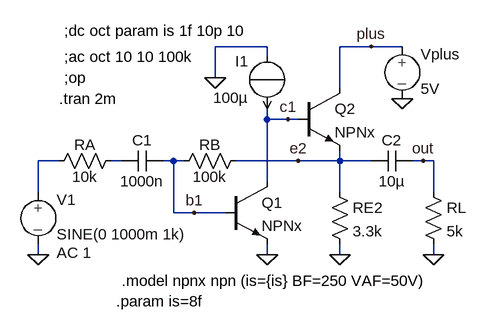
[diagram p0: schematic verst-2-transistoren-npn-aussteuergrenzen.asc]
verst-2-transistoren-npn-aussteuergrenzen.asc, the LTspice schematic file:
Version 4
SHEET 1 880 680
WIRE 192 16 112 16
WIRE 352 16 304 16
WIRE 400 16 352 16
WIRE 192 32 192 16
WIRE 112 64 112 16
WIRE 304 80 304 16
WIRE 192 128 192 112
WIRE 224 128 192 128
WIRE 240 128 224 128
WIRE -128 192 -160 192
WIRE -32 192 -48 192
WIRE 48 192 32 192
WIRE 64 192 48 192
WIRE 240 192 144 192
WIRE 304 192 304 176
WIRE 304 192 240 192
WIRE 352 192 304 192
WIRE 432 192 416 192
WIRE 448 192 432 192
WIRE 192 224 192 128
WIRE -160 240 -160 192
WIRE 304 240 304 192
WIRE 448 240 448 192
WIRE 48 272 48 192
WIRE 80 272 48 272
WIRE 128 272 80 272
WIRE -160 336 -160 320
WIRE 192 336 192 320
WIRE 304 336 304 320
WIRE 448 336 448 320
FLAG 192 336 0
FLAG 112 64 0
FLAG 400 96 0
FLAG 304 336 0
FLAG 240 192 e2
FLAG 80 272 b1
FLAG 224 128 c1
FLAG 448 336 0
FLAG -160 336 0
FLAG 352 16 plus
FLAG 432 192 out
SYMBOL EIT_Semiconductors\\npn 128 224 R0
SYMATTR InstName Q1
SYMATTR Value NPNx
SYMBOL EIT_Semiconductors\\npn 240 80 R0
SYMATTR InstName Q2
SYMATTR Value NPNx
SYMBOL res 160 176 R90
WINDOW 0 7 56 VBottom 2
WINDOW 3 25 56 VTop 2
SYMATTR InstName RB
SYMATTR Value 100k
SYMBOL source-V 400 0 R0
SYMATTR InstName Vplus
SYMATTR Value 5V
SYMBOL res 288 224 R0
SYMATTR InstName RE2
SYMATTR Value 3.3k
SYMBOL res 432 224 R0
SYMATTR InstName RL
SYMATTR Value 5k
SYMBOL cap 352 208 R270
WINDOW 0 32 32 VTop 2
WINDOW 3 0 32 VBottom 2
SYMATTR InstName C2
SYMATTR Value 10µ
SYMBOL cap -32 208 R270
WINDOW 0 32 32 VTop 2
WINDOW 3 0 32 VBottom 2
SYMATTR InstName C1
SYMATTR Value 1000n
SYMBOL res -144 208 R270
WINDOW 0 25 56 VTop 2
WINDOW 3 7 56 VBottom 2
SYMATTR InstName RA
SYMATTR Value 10k
SYMBOL source-V -160 224 R0
WINDOW 123 28 109 Left 2
WINDOW 39 0 0 Left 2
SYMATTR InstName V1
SYMATTR Value SINE(0 1000m 1k)
SYMATTR Value2 AC 1
SYMBOL source-I 192 112 R180
WINDOW 0 29 73 Left 2
WINDOW 3 29 17 Left 2
SYMATTR InstName I1
SYMATTR Value 100µ
TEXT -32 376 Left 2 !.model npnx npn (is={is} BF=250 VAF=50V)
TEXT -120 64 Left 2 !;op
TEXT -40 408 Left 2 !.param is=8f
TEXT -120 -8 Left 2 !;dc oct param is 1f 10p 10
TEXT -120 32 Left 2 !;ac oct 10 10 100k
TEXT -128 96 Left 2 !.tran 2m

The netlist it stands for:
* verst-2-transistoren-npn-aussteuergrenzen.asc
Q1 c1 b1 0 0 NPNx
Q2 plus c1 e2 0 NPNx
RB e2 b1 100k
Vplus plus 0 5V
RE2 e2 0 3.3k
RL out 0 5k
C2 e2 out 10µ
C1 N002 b1 1000n
RA N001 N002 10k
V1 N001 0 SINE(0 1000m 1k) AC 1
I1 0 c1 100µ
.model NPN NPN
.model PNP PNP
.lib standard.bjt
.model npnx npn (is={is} BF=250 VAF=50V)
;op
.param is=8f
;dc oct param is 1f 10p 10
;ac oct 10 10 100k
.tran 2m
.backanno
.end